# Altium project CAPACITOR_CHARGER.PrjPcb
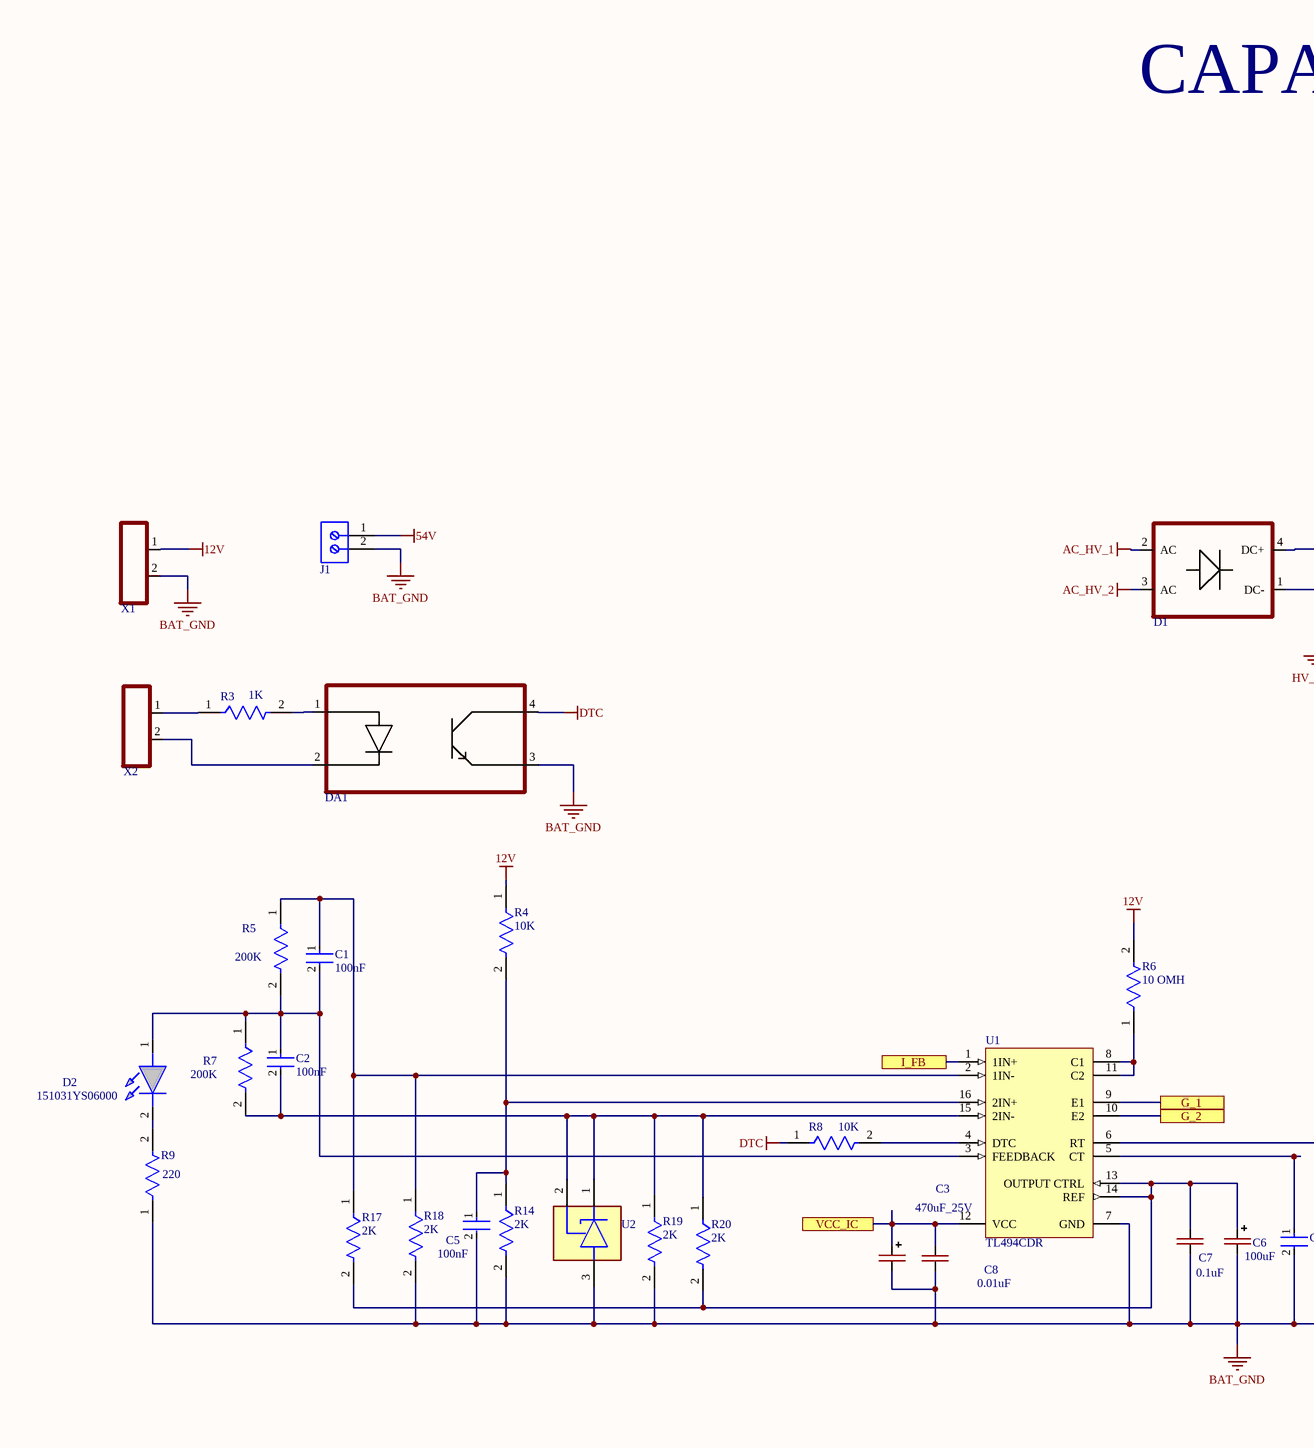
[diagram p0: CAPACITOR_CHARGER.SchDoc, left]
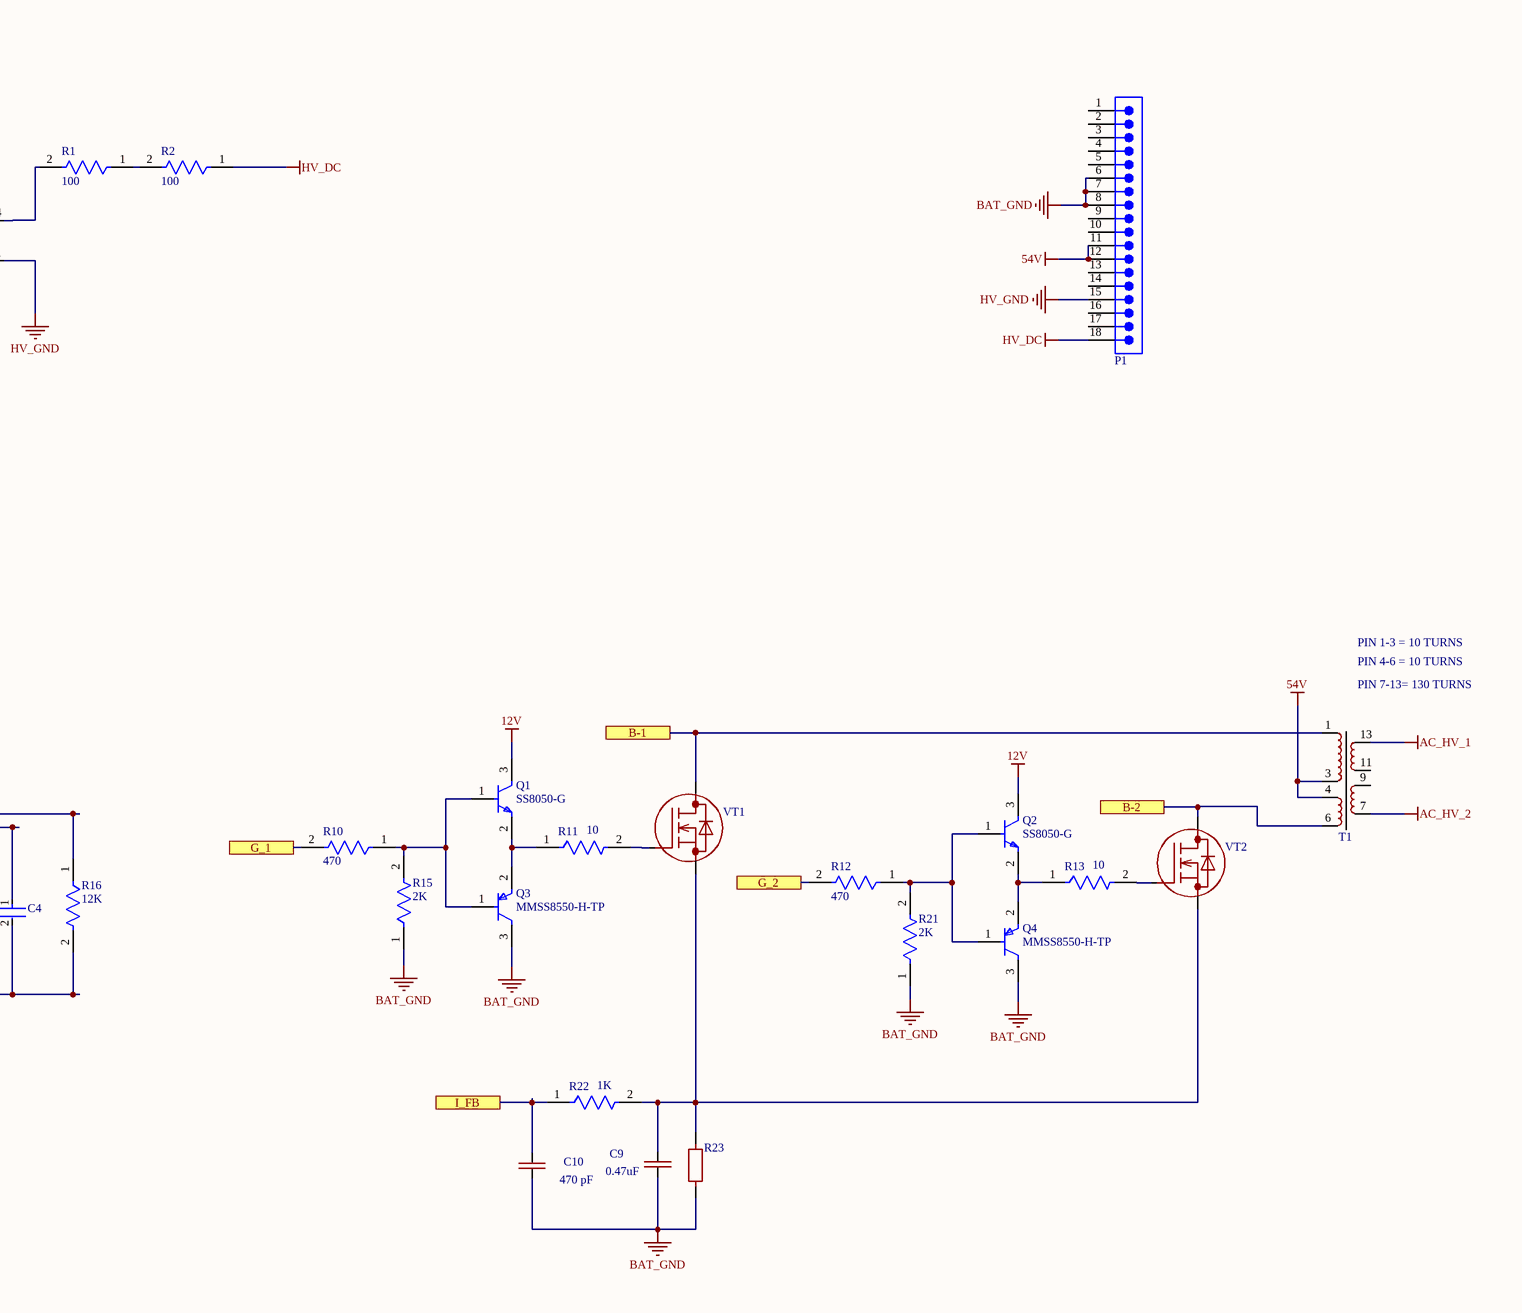
[diagram p1: CAPACITOR_CHARGER.SchDoc, right]
1 sheet, 49 parts. Net scope: flat (ports and power ports of the same name join across sheets).
Board file: CAPACITOR_CHARGER.PcbDoc

## Sheet CAPACITOR_CHARGER.SchDoc
size A2; SheetNumber: 1; SheetTotal: 1; SPICEModelCacheUJGLTUQW: <root> / <DocumentId>UJGLTUQW</DocumentId> / </root>

### Parts
C1  100nF  [FP-C0805C-DN-MFG]
C2  100nF  [FP-C0805C-DN-MFG]
C3  470uF_25V  [CAP_SMD_Size_G]
C4  C0805C102K5RACTU  [FP-C0805C-DN-MFG]  (value not drawn)
C5  100nF  [FP-C0805C-DN-MFG]
C6  100uF  [CAP-TAN-D]
C7  0.1uF  [CAP-0805]
C8  0.01uF  [CAP-0805]
C9  0.47uF  [CAP-0805]
C10  470 pF  [CAP-0805]
D1  RS40X  [RS40X]  (value not drawn)
D2  151031YS06000  [LED_RED]
DA1  PC817  [4-SMD]  (value not drawn)
J1  691101710002  [691101710002]  (value not drawn)
P1  61301811021  [61301811021]  (value not drawn)
Q1  SS8050-G  [FP-SS8050-G-MFG]
Q2  SS8050-G  [FP-SS8050-G-MFG]
Q3  MMSS8550-H-TP  [FP-SOT-23-IPC_B]
Q4  MMSS8550-H-TP  [FP-SOT-23-IPC_B]
R1  100  [RES-2W]
R2  100  [RES-2W]
R3  1K  [RES-0805]
R4  10K  [FP-CRCW0805-e3-MFG]
R5  200K  [FP-CRCW0805-e3-MFG]
R6  10 OMH  [RES-1206]
R7  200K  [FP-CRCW0805-e3-MFG]
R8  10K  [RES-0805]
R9  220  [RES-0805]
R10  470  [RES-0805]
R11  10  [RES-0805]
R12  470  [RES-0805]
R13  10  [RES-0805]
R14  2K  [FP-CRCW0805-e3-MFG]
R15  2K  [RES-0805]
R16  12K  [FP-CRCW0805-e3-MFG]
R17  2K  [FP-CRCW0805-e3-MFG]
R18  2K  [FP-CRCW0805-e3-MFG]
R19  2K  [FP-CRCW0805-e3-MFG]
R20  2K  [FP-CRCW0805-e3-MFG]
R21  2K  [RES-0805]
R22  1K  [RES-0805]
R23  (no value)  [RES-2W]
T1  ETD29  [TRANS_ETD_29]  (value not drawn)
U1  TL494CDR  [D0016A_N]
U2  TL431  [TL431_SOT-23-3(A)]  (value not drawn)
VT1  MOSFET-N-GDS  [TO-220-3]  (value not drawn)
VT2  MOSFET-N-GDS  [TO-220-3]  (value not drawn)
X1  CONN-2-PIN  [XH2-]  (value not drawn)
X2  CONN-2-PIN  [XH2-]  (value not drawn)

### Ports
B-1, B-2, G_1, G_2, I_FB, VCC_IC

### Nets
12V: Q1.3(C) Q2.3(C) R4.1 R6.2 X1.1
54V: J1.1 P1.11 P1.12 T1.3 T1.4
AC_HV_1: D1.2(AC) T1.13
AC_HV_2: D1.3(AC) T1.7
BAT_GND: C3.2(-) C4.2 C5.2 C6.2(-) C7.1 C8.1 C9.1 C10.1 DA1.3(EMITTER) J1.2 P1.6 P1.7 P1.8 Q3.3(C) Q4.3(C) R9.1 R14.2 R15.1 R16.2 R18.2 R19.2 R21.1 R23.1 U1.7(GND) U2.3(A) X1.2
DTC: DA1.4(COLLECTOR) R8.1
HV_DC: P1.18 R2.1
HV_GND: D1.1(DC-) P1.15
NetC1_1: C1.1 R5.1 R17.1 R18.1 U1.2(1IN-)
NetC1_2: C1.2 C2.1 D2.1(A) R5.2 R7.1 U1.3(FEEDBACK)
NetC2_2: C2.2 R7.2 R19.1 R20.1 U1.15(2IN-) U2.1(C) U2.2(REF)
NetC3_1: C3.1(+) C8.2 U1.12(VCC) ; port VCC_IC
NetC4_1: C4.1 U1.5(CT)
NetC5_1: C5.1 R4.2 R14.1 U1.16(2IN+)
NetC6_1: C6.1(+) C7.2 R17.2 R20.2 U1.13(OUTPUT_CTRL) U1.14(REF)
NetC9_2: C9.2 R22.2 R23.2 VT1.3(S) VT2.3(S)
NetC10_2: C10.2 R22.1 U1.1(1IN+) ; port I_FB
NetD1_4: D1.4(DC+) R1.2
NetD2_2: D2.2(K) R9.2
NetDA1_1: DA1.1(ANODE) R3.2
NetDA1_2: DA1.2(CATHODE) X2.2
NetQ1_1: Q1.1(B) Q3.1(B) R10.1 R15.2
NetQ1_2: Q1.2(E) Q3.2(E) R11.1
NetQ2_1: Q2.1(B) Q4.1(B) R12.1 R21.2
NetQ2_2: Q2.2(E) Q4.2(E) R13.1
NetR1_1: R1.1 R2.2
NetR3_1: R3.1 X2.1
NetR6_1: R6.1 U1.8(C1) U1.11(C2)
NetR8_2: R8.2 U1.4(DTC)
NetR10_2: R10.2 U1.9(E1) ; port G_1
NetR11_2: R11.2 VT1.1(G)
NetR12_2: R12.2 U1.10(E2) ; port G_2
NetR13_2: R13.2 VT2.1(G)
NetR16_1: R16.1 U1.6(RT)
NetT1_1: T1.1 VT1.2(D) ; port B-1
NetT1_6: T1.6 VT2.2(D) ; port B-2

Not connected (* = marked no-connect by the designer): P1 1 2 3 4 5 9 10 13 14 16 17; T1 9 11

### Notes on the sheet
- CAPACITOR_CHARGER
- PIN 1-3 = 10 TURNS
- PIN 4-6 = 10 TURNS
- (near T1) PIN 7-13= 130 TURNS

### Library data of the parts
C1 C2 C5 = CMP-2007-00254-2: CAP CER 10000PF 50V X7R 0805; Manufacturer Part Number: C0805C103J5RACTU; Manufacturer: KEMET; Value: 10,000 pF; Material: Ceramic; Temperature Coefficient: 30ppm/°C; Tolerance: 0.05; Device Class L1: Passive Components; Temperature: -55°C to +125°C; Lead Free: Yes; ComponentLink2URL: https://content.kemet.com/datasheets/KEM_C1003_C0G_SMD.pdf; Device Class L3: Ceramic Capacitors; Temperature Characteristic: X7R; Temperature Range High: +125°C; Mouser Description: Capacitor; Ceramic; Cap 0.01uF; Tol 5%; Vol-Rtg 50 V; SMT; Case 0805; X7R; TR; ComponentLink2Description: Datasheet; Height: 0.88mm; Digikey Description: CAP CER 10000PF 50V X7R 0805; Capacitance: 10,000 pF; Temperature Range Low: -55°C; Device Class L2: Capacitors; Octopart: https://octopart.com/c0805c103j5ractu-kemet-133473; Voltage Rating: 50 V; Category: Cap; RoHS: TRUE; Automotive: No; Package: C0805C-DN; Ipc Land Pattern Name: CAPC200125X78
C3 C6 = CAP-POLAR
C4 = CMP-2007-01097-2: CAP CER 1000PF 50V X7R 0805; Manufacturer: KEMET; Capacitance: 1,000 pF; Value: 1,000 pF; Tolerance: 0.1; Temperature Coefficient: 30ppm/°C; Material: Ceramic; Temperature Range High: +125°C; Automotive: No; Device Class L3: Ceramic Capacitors; Category: Cap; Height: 0.88mm; Ipc Land Pattern Name: CAPC200125X78; Mouser Description: Cap Ceramic 0.001uF 50V X7R 10% SMD 0805 125C Plastic T/R; Device Class L1: Passive Components; Lead Free: Yes; Temperature Range Low: -55°C; ComponentLink2URL: https://content.kemet.com/datasheets/KEM_C1003_C0G_SMD.pdf; Octopart: https://octopart.com/c0805c102k5ractu-kemet-93010; Temperature: -55°C to +125°C; Package: C0805C-DN; RoHS: TRUE; Voltage Rating: 50 V; ComponentLink2Description: Datasheet; Digikey Description: CAP CER 1000PF 50V X7R 0805; Device Class L2: Capacitors; Manufacturer Part Number: C0805C102K5RACTU; Temperature Characteristic: X7R
C7-C10 = CAP-NON-POLAR
D2 = LED: WURTH ELEKTRONIK - 151031YS06000 - LED, Yellow, Through Hole, T-1 (3mm), 30 mA, 2 V, 590 nm; Geometry.Height: 5.5mm; Manufacturer_Name: Wurth Elektronik; Manufacturer_Part_Number: 151031YS06000; Mouser Part Number: 710-151031YS06000; Mouser Price/Stock: https://www.mouser.co.uk/ProductDetail/Wurth-Elektronik/151031YS06000?qs=LlUlMxKIyB3xSYYW%252BcuBiQ%3D%3D; Arrow Part Number: *; Arrow Price/Stock: *; Mouser Testing Part Number: *; Mouser Testing Price/Stock: *; Datasheet Link: https://katalog.we-online.de/led/datasheet/151031YS06000.pdf
J1 = 691101710002: WR-TBL Series 101 Horizontal Entry Modular, THT, pitch 5mm, 2p; Manufacturer: Wurth Elektronik; Modularity: Yes; Rated Current: 16A; Working Voltage: 250V; ComponentLink1Description: Website Link; ComponentLink1URL: https://www.we-online.com/redexpert/article/691101710002?ad; ComponentLink2Description: Datasheet Link; ComponentLink2URL: https://www.we-online.com/redexpert/spec/691101710002?ad; Manufacturer Part Number: 691101710002; Category: Terminal Blocks; Match Code: WR-TBL; Mount: Through Hole; Operating Temperature Max: 105°C; Operating Temperature Min: -40°C; Packaging: Box; Application: Pressure Clamp; Number of Pins: 2; Number of Rows: 1; Orientation: Horizontal; Pitch: 5mm
P1 = 61301811021: WR-PHD Pin Header, THT, Angled, pitch 2.54mm, 1 Row, 18P; Manufacturer: Wurth Elektronik; Contact Resistance: 20mΩ; Rated Current: 3A; Working Voltage: 250V; Withstanding Voltage: 500V; ComponentLink1Description: Website Link; ComponentLink1URL: https://www.we-online.com/redexpert/article/61301811021?ad; ComponentLink2Description: Datasheet Link; ComponentLink2URL: https://www.we-online.com/redexpert/spec/61301811021?ad; Manufacturer Part Number: 61301811021; Category: Board-to-Board Connectors; Match Code: WR-PHD; Mount: Through Hole; Operating Temperature Max: 105°C; Operating Temperature Min: -40°C; Packaging: Bag; Gender: Pin Header; Number of Pins: 18; Number of Rows: 1; Orientation: Angled; Pitch: 2.54mm
Q1 Q2 = CMP-20235-000001-1: NPN TRANSISTOR 1.5A 40V SOT-23 R; Transition Frequency: 100MHz; Max Breakdown Voltage: 25V; Collector Emitter Voltage (VCEO): 400mV; Max Power Dissipation: 300mW; Max Collector Current: 1.5A; Case/Package: TO-236-3; Packaging: Tape and Reel; RoHS Compliant: Yes; Mount: Surface Mount; Collector Emitter Breakdown Voltage: 25V
Q3 Q4 = CMP-56214-000002-1: TRANS PNP 25V 1.5A SOT23; Emitter Base Voltage (VEBO): 1.6V; Collector Base Voltage (VCBO): 40V; Collector Emitter Saturation Voltage: 500mV; Max Power Dissipation: 625mW; Transition Frequency: 100MHz; Element Configuration: Single; hFE Min: 40; Polarity: PNP; Lead Free: Lead Free; Max Breakdown Voltage: 25V; Package Quantity: 1; Min Operating Temperature: -55°C; Case/Package: SOT-23; Max Collector Current: 1.5A; Mount: Surface Mount; Packaging: Tape and Reel; Collector Emitter Voltage (VCEO): 500mV; Max Operating Temperature: 150°C; Gain Bandwidth Product: 100MHz; Collector Emitter Breakdown Voltage: 25V
R1-R3 R6 R8-R13 R15 R21-R23 = RES-CONST
R4 R5 R7 R14 R17 R19 R20 = CMP-2001-04908-2: RES Thick Film, 2kΩ, 1%, 0.125W, 100ppm/°C, 0805; Resistance: 10kR; Voltage Rating (DC): 150V; Power Rating: 125mW; Weight: 0.000194oz; Package Quantity: 5000; Military Standard: Not; Max Operating Temperature: 155°C; Temperature Coefficient: 100ppm/°C; Contact Plating: Tin; Width: 1.25mm; Height: 0.45mm; Radiation Hardening: No; Tolerance: 1%; Min Operating Temperature: -55°C; Voltage Rating: 150V; Length: 2mm; Depth: 1.25mm; Termination: SMD/SMT; Packaging: Tape and Reel; Case/Package: 0805; Case Code (Metric): 2012; Lead Free: Lead Free; Case Code (Imperial): 0805; Composition: Thick Film
R16 = CMP-2001-04908-2: RES Thick Film, 12kΩ, 1%, 0.125W, 100ppm/°C, 0805; Resistance: 10kR; Voltage Rating (DC): 150V; Power Rating: 125mW; Weight: 0.000194oz; Package Quantity: 5000; Military Standard: Not; Max Operating Temperature: 155°C; Temperature Coefficient: 100ppm/°C; Contact Plating: Tin; Width: 1.25mm; Height: 0.45mm; Radiation Hardening: No; Tolerance: 1%; Min Operating Temperature: -55°C; Voltage Rating: 150V; Length: 2mm; Depth: 1.25mm; Termination: SMD/SMT; Packaging: Tape and Reel; Case/Package: 0805; Case Code (Metric): 2012; Lead Free: Lead Free; Case Code (Imperial): 0805; Composition: Thick Film
R18 = CMP-2001-04908-2: RES Thick Film, 82kΩ, 1%, 0.125W, 100ppm/°C, 0805; Resistance: 10kR; Voltage Rating (DC): 150V; Power Rating: 125mW; Weight: 0.000194oz; Package Quantity: 5000; Military Standard: Not; Max Operating Temperature: 155°C; Temperature Coefficient: 100ppm/°C; Contact Plating: Tin; Width: 1.25mm; Height: 0.45mm; Radiation Hardening: No; Tolerance: 1%; Min Operating Temperature: -55°C; Voltage Rating: 150V; Length: 2mm; Depth: 1.25mm; Termination: SMD/SMT; Packaging: Tape and Reel; Case/Package: 0805; Case Code (Metric): 2012; Lead Free: Lead Free; Case Code (Imperial): 0805; Composition: Thick Film
T1 = Trans_ETD59
U1 = CMP-0319-00950-2: Pulse-Width-Modulation Control Circuit with Voltage Control, 45 % Duty Cycle, 0 to +70 degC, 16-pin SOIC (D), Green (RoHS & no Sb/Br); Manufacturer: Texas Instruments; Regulated Outputs(#): 2; Frequency(Max)(kHz): 300; Topology: Boost, Buck, Flyback, Forward, Full-Bridge, Half-Bridge, Push-Pull; SubFamily: PWM Controller; Duty Cycle(Max)(%): 45; Rating: Military; PackageDescription: 16-Pin Plastic Small Outline Integrated Circuit, 9.9 x 3.9 mm, Pitch 1.27 mm Pitch; Mounting Technology: Surface Mount; PackageReference: D0016A; DatasheetVersion: SLVS074E; Control Method: Voltage; ComponentLink1Description: Datasheet; ComponentLink1URL: http://www.ti.com/general/docs/lit/getliterature.tsp?genericPartNumber=TL494&fileType=pdf; Code_JEDEC: MS-012AC; Eco-Plan: Green (RoHS & no Sb/Br); PackageVersion: revM, Jun-2011; PartNumber: TL494CDR
U2 = TL431_SOT-23-3